# Altium schematic sheet SQUID_Power.SchDoc: FPGA Motherboard for Digital Multiplexed Readout, McGill U.
size A portrait; DocumentNumber: DfMUX20; Revision: Rev0, Prototype; SheetNumber: 20; SheetTotal: 27; PageSetup: Record=PageOptions|CenterHorizontal=True|CenterVertical=True|PrintScale=1.05|XCorrection=1.00|YCorrection=1.00|PrintKind=0|BorderSize=5000000|LeftOffset=0|BottomOffset=0|Orientation=1|PaperLength=1000|PaperWidth=1000|Scale=100|PaperSource=1|PrintQuality=300|MediaType=1|DitherType=10|PaperKind=Letter|PrintScaleMode=1
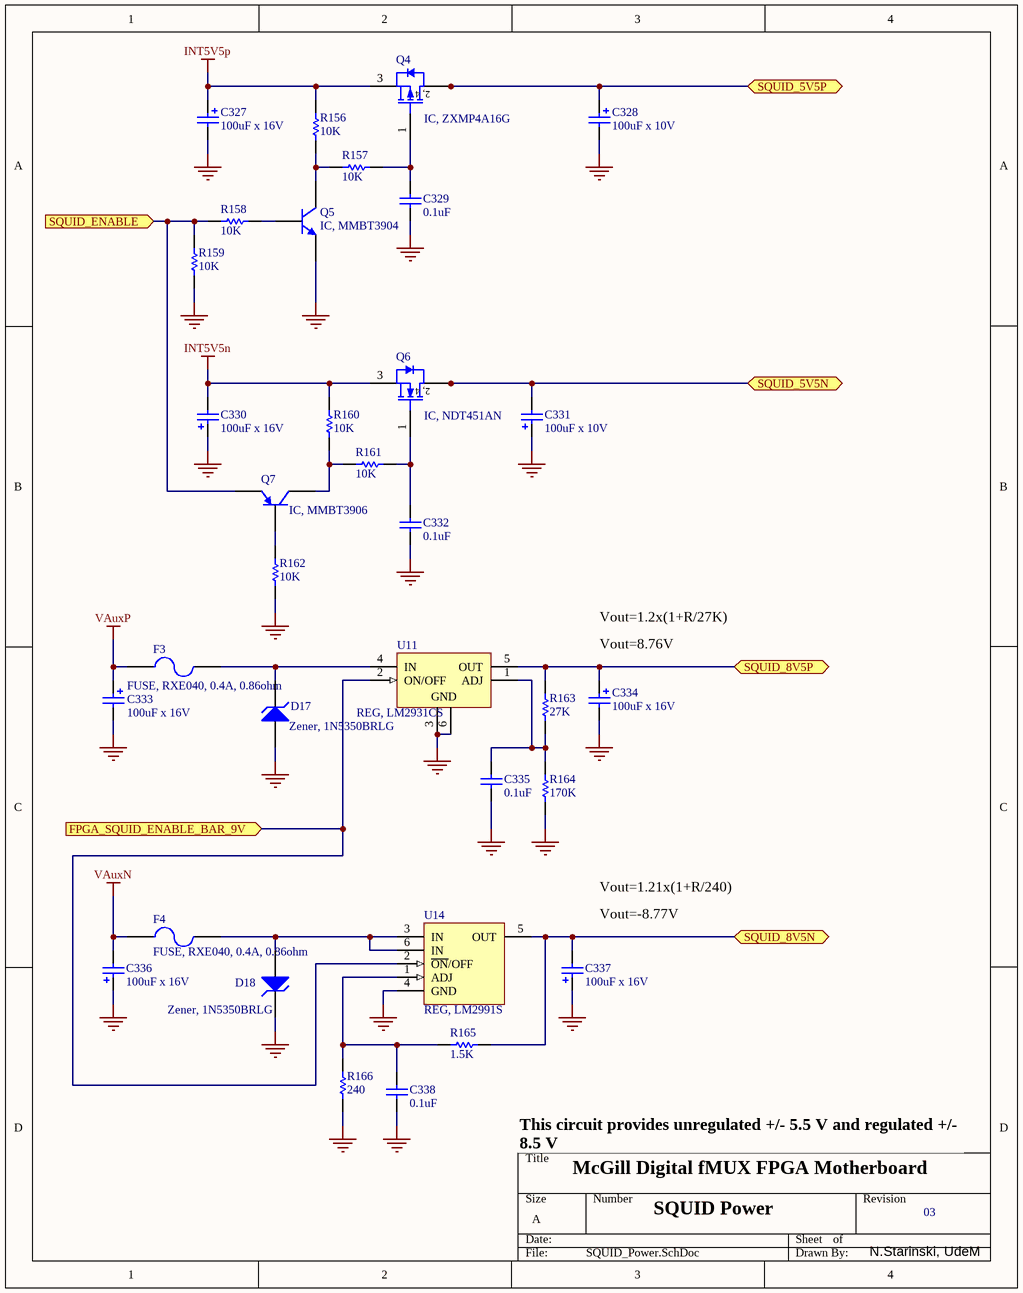
[diagram p0: SQUID_Power.SchDoc]

## Parts
C327  100uF x 16V  [CC7343-31_Dsize]
C328  100uF x 10V  [TC6032-2412]
C329  0.1uF  [CC1608-0603]
C330  100uF x 16V  [CC7343-31_Dsize]
C331  100uF x 10V  [TC6032-2412]
C332  0.1uF  [CC1608-0603]
C333  100uF x 16V  [CC7343-31_Dsize]
C334  100uF x 16V  [CC7343-31_Dsize]
C335  0.1uF  [CC1608-0603]
C336  100uF x 16V  [CC7343-31_Dsize]
C337  100uF x 16V  [CC7343-31_Dsize]
C338  0.1uF  [CC1608-0603]
D17  Zener, 1N5350BRLG  [A-500]
D18  Zener, 1N5350BRLG  [A-500]
F3  FUSE, RXE040, 0.4A, 0.86ohm  [Fuse 5.88mm]
F4  FUSE, RXE040, 0.4A, 0.86ohm  [Fuse 5.88mm]
Q4  IC, ZXMP4A16G  [SOT223]
Q5  IC, MMBT3904  [SOT23]
Q6  IC, NDT451AN  [SOT223]
Q7  IC, MMBT3906  [SOT23]
R156  10K  [CR1608-0603]
R157  10K  [CR1608-0603]
R158  10K  [CR1608-0603]
R159  10K  [CR1608-0603]
R160  10K  [CR1608-0603]
R161  10K  [CR1608-0603]
R162  10K  [CR1608-0603]
R163  27K  [CR1608-0603]
R164  170K  [CR1608-0603]
R165  1.5K  [CR1608-0603]
R166  240  [CR1608-0603]
U11  REG, LM2931CS  [TS5B]
U14  REG, LM2991S  [TS5B]

## Ports
FPGA_SQUID_ENABLE_BAR_9V (in), SQUID_5V5N (bidir), SQUID_5V5P (bidir), SQUID_8V5N, SQUID_8V5P, SQUID_ENABLE (in)

## Nets
GND: C327.2 C328.2 C329.1 C330.1 C331.1 C332.1 C333.2 C334.2 C335.1 C336.1 C337.1 C338.1 D17.1(A) D18.2(K) Q5.2(E) R159.1 R162.1 R164.1 R166.1 U11.3(GND) U11.6(GND_(TAB)) U14.4(GND)
INT5V5n: C330.2 Q6.3(S) R160.2
INT5V5p: C327.1 Q4.3(S) R156.2
VAuxN: C336.2 F4.1
VAuxP: C333.1 F3.1
FPGA_SQUID_ENABLE_BAR_9V: U11.2(ON/OFF) U14.2(~{ON}/OFF) ; port FPGA_SQUID_ENABLE_BAR_9V
SQUID_5V5N: C331.2 Q6.2(D) Q6.4(D) ; port SQUID_5V5N
SQUID_5V5P: C328.1 Q4.2(D) Q4.4(D) ; port SQUID_5V5P
SQUID_8V5N: C337.2 R165.2 U14.5(OUT) ; port SQUID_8V5N
SQUID_8V5P: C334.1 R163.2 U11.5(OUT) ; port SQUID_8V5P
SQUID_ENABLE: Q7.2(E) R158.1 R159.2 ; port SQUID_ENABLE
NetC329_2: C329.2 Q4.1(G) R157.2
NetC332_2: C332.2 Q6.1(G) R161.2
NetC335_2: C335.2 R163.1 R164.2 U11.1(ADJ)
NetC338_2: C338.2 R165.1 R166.2 U14.1(ADJ)
NetD17_2: D17.2(K) F3.2 U11.4(IN)
NetD18_1: D18.1(A) F4.2 U14.3(IN) U14.6(IN)
NetQ5_1: Q5.1(B) R158.2
NetQ5_3: Q5.3(C) R156.1 R157.1
NetQ7_1: Q7.1(B) R162.2
NetQ7_3: Q7.3(C) R160.1 R161.1

## Notes on the sheet
- Vout=1.2x(1+R/27K)
- (near C334) Vout=8.76V
- Vout=1.21x(1+R/240)
- (near C337) Vout=-8.77V
- This circuit provides unregulated +/- 5.5 V and regulated +/- 8.5 V
  to a DB25F port which is used to power the SQUID controller.
- McGill Digital fMUX FPGA Motherboard
- SQUID Power
- 03
- N.Starinski, UdeM
- (in symbol ZXMN10A11G) 2, 4
- (in symbol ZXMP4A16G) 2, 4

## Library data of the parts
C327 C330 C333 C334 C336 C337 = Cap Pol3: CAP TANTD TPSD107M016R0060; Published: 8-Jun-2000; LatestRevisionDate: 17-Jul-2002; LatestRevisionNote: Re-released for DXP Platform.; PackageReference: C0805; Publisher: Altium Limited
C328 C331 = Cap Pol3: CAP TANTC TPSC107K010R0075; Published: 8-Jun-2000; LatestRevisionDate: 17-Jul-2002; LatestRevisionNote: Re-released for DXP Platform.; PackageReference: C0805; Publisher: Altium Limited
C329 C332 C335 C338 = Cap Semi: Capacitor (Semiconductor SIM Model); Published: 8-Jun-2000; LatestRevisionDate: 17-Jul-2002; LatestRevisionNote: Re-released for DXP Platform.; PackageReference: C1206; Publisher: Altium Limited
D17 D18 = 1N5350B: Zener Diode, 13V, 5W; Published: 8-Jun-2000; LatestRevisionDate: 17-Jul-2002; LatestRevisionNote: Re-released for DXP Platform.; PackageReference: A-500; Publisher: Altium Limited; ComponentLink1Description: Manufacturer Link; ComponentLink1URL: http://www.vishay.com/
F3 F4 = Fuse 2: Fuse; Published: 8-Jun-2000; LatestRevisionDate: 17-Jul-2002; LatestRevisionNote: Re-released for DXP Platform.; Publisher: Altium Limited
Q4 = ZXMP4A16G: 40V P-Channel Enhancement Mode MOSFET; PackageDocument: 2002; Published: 17-Dec-2003; DatasheetDocument: Jul-03; PackageReference: SOT223; Publisher: Altium Limited; Code_JEDEC: TO-261-AA-B; ComponentLink1Description: Manufacturer Link; ComponentLink1URL: http://www.zetex.com/; ComponentLink2Description: Datasheet; ComponentLink2URL: www.zetex.com/3.0/pdf/ZXMP4A16G.pdf
Q5 = MMBT3904: NPN Switching Transistor; Published: 17-Sep-2003; DatasheetDocument: 13-May-2002; PackageDocument: May-1999; PackageReference: SOT23; Publisher: Altium Limited; ComponentLink1Description: Manufacturer Link; ComponentLink1URL: http://www.semiconductors.philips.com/; ComponentLink2Description: Datasheet; ComponentLink2URL: http://www.semiconductors.philips.com/acrobat/datasheets/MMBT3904_4.pdf
Q6 = ZXMN10A11G: 100V N-Channel Enhancement Mode MOSFET; PackageDocument: 2002; Published: 17-Dec-2003; DatasheetDocument: Mar-02; PackageReference: SOT223; Publisher: Altium Limited; Code_JEDEC: TO-261-AA-B; ComponentLink1Description: Manufacturer Link; ComponentLink1URL: http://www.zetex.com/; ComponentLink2Description: Datasheet; ComponentLink2URL: www.zetex.com/3.0/pdf/ZXMN10A11G.pdf
Q7 = MMBT3906: PNP Switching Transistor; Published: 17-Sep-2003; DatasheetDocument: 11-Apr-2000; PackageDocument: May-1999; PackageReference: SOT23; Publisher: Altium Limited; ComponentLink1Description: Manufacturer Link; ComponentLink1URL: http://www.semiconductors.philips.com/; ComponentLink2Description: Datasheet; ComponentLink2URL: http://www.semiconductors.philips.com/acrobat/datasheets/MMBT3906_2.pdf
R156-R166 = Res Semi: Resistor 0603; Published: 8-Jun-2000; LatestRevisionDate: 17-Jul-2002; LatestRevisionNote: Re-released for DXP Platform.; Publisher: Altium Limited
U11 = LM2931CS: Series Low-Dropout Regulator; Note: Tab is GND; Published: 15-Apr-2002; DatasheetDocument: Apr-1998; PackageReference: TS5B; Publisher: Altium Limited; ComponentLink1Description: Manufacturer Link; ComponentLink1URL: http://www.national.com/
U14 = LM2991S: Negative Low-Dropout Adjustable Regulator; Note: Tab is Input; Published: 15-Apr-2002; DatasheetDocument: May-1999; PackageReference: TS5B; Publisher: Altium Limited; ComponentLink1Description: Manufacturer Link; ComponentLink1URL: http://www.national.com/